# Altium schematic sheet 4_PROFIBUS1.schdoc
size 307 x 218 mm; Symbol: Drawing-Symbol_A4; Device: Drawing-Symbol_A4; Company: 嘉立创EDA; Version: V1.0; Page Size: A4; @Project Name: 工程文件; @Page Count: 7; @Update Date: 2025-06-13; @Create Date: 2025-06-12; @Schematic Name: Schematic1; @Page No: 4; @Page Name: PROFIBUS1; @Create Time: 03:00:09; @Update Time: 17:10:50; Width: 1170; Height: 825; Region Start: 1; X Region Count: 6; Y Region Count: 4; Blade Width: 10; Title Block Position: 3; @Board Name: Board1
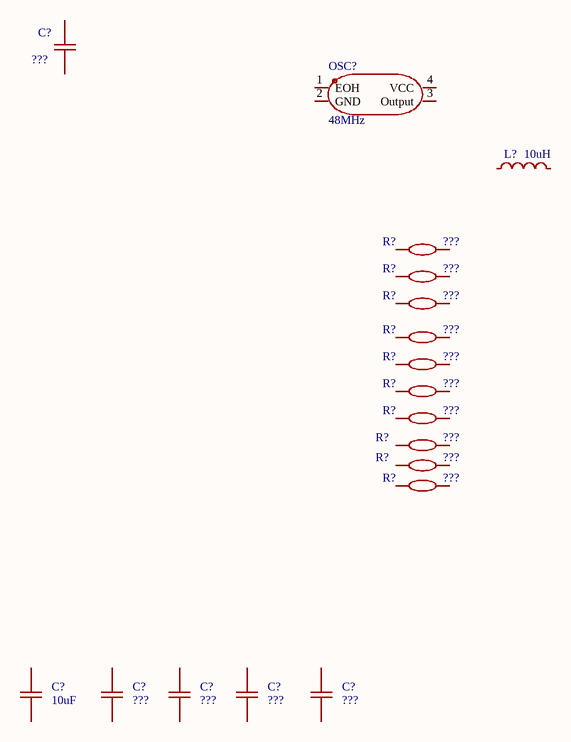
[diagram p0: 4_PROFIBUS1.schdoc]

## Parts
(Parts that share a designator on the sheet are numbered #1, #2 ... from top to bottom, then left to right.)
C?#1  ???  [C0402]
C?#2  10uF  [C0603]
C?#3  ???  [C0402]
C?#4  ???  [C0402]
C?#5  ???  [C0402]
C?#6  ???  [C0402]
L?  10uH  [L0402]
OSC?  48MHz  [OSC-SMD_4P-L2.0-W1.6-BL]
R?#1  ???  [R0402]
R?#2  ???  [R0402]
R?#3  ???  [R0402]
R?#4  ???  [R0402]
R?#5  ???  [R0402]
R?#6  ???  [R0402]
R?#7  ???  [R0402]
R?#8  ???  [R0402]
R?#9  ???  [R0402]
R?#10  ???  [R0402]

## Nets

Not connected (* = marked no-connect by the designer): C?#1 1 2; C?#2 1 2; C?#3 1 2; C?#4 1 2; C?#5 1 2; C?#6 1 2; L? 1 2; OSC? 1(EOH) 2(GND) 3(Output) 4(VCC); R?#1 1 2; R?#2 1 2; R?#3 1 2; R?#4 1 2; R?#5 1 2; R?#6 1 2; R?#7 1 2; R?#8 1 2; R?#9 1 2; R?#10 1 2

## Notes on the sheet
- 1
- 2
- 3
- 4
- 5
- 6
- A
- B
- C
- D

## Library data of the parts
C?#1 C?#3-C?#6 = CAP_0402: Symbol: CapAcitance; Convert to PCB: yes; Device: CAP_0402; Add into BOM: yes; Value: ???
C?#2 = CAP_0603: Symbol: CapAcitance; Convert to PCB: yes; Device: CAP_0603; Add into BOM: yes; Value: 10uF
L? = L_0402: Symbol: SDCL1005C10NJTDFM01; Add into BOM: yes; Device: L_0402; Convert to PCB: yes; Value: 10uH
OSC? = CA20C4805INT: Manufacturer: CTS(西迪斯); Add into BOM: yes; Output Type: HCMOS；TTL; Supply Voltage: 2.5V; Supply Current (Max): 15mA; Symbol: CA20C4805INT; Device: CA20C4805INT; LCSC Part Name: CA20C4805INT; Supplier Part: C1990976; Manufacturer Part: CA20C4805INT; Supplier Footprint: SMD2016-4P; JLCPCB Part Class: 扩展库; Datasheet: https://atta.szlcsc.com/upload/public/pdf/source/20210702/BDFC52EAD60C3547BAEE0A1F7A9586ED.pdf; Supplier: LCSC; Convert to PCB: yes; Value: 48MHz; Operating Temperature: -40℃~+85℃
R?#1-R?#10 = Res_0402: Symbol: 电阻; Convert to PCB: yes; Device: Res_0402; Add into BOM: yes; Value: ???